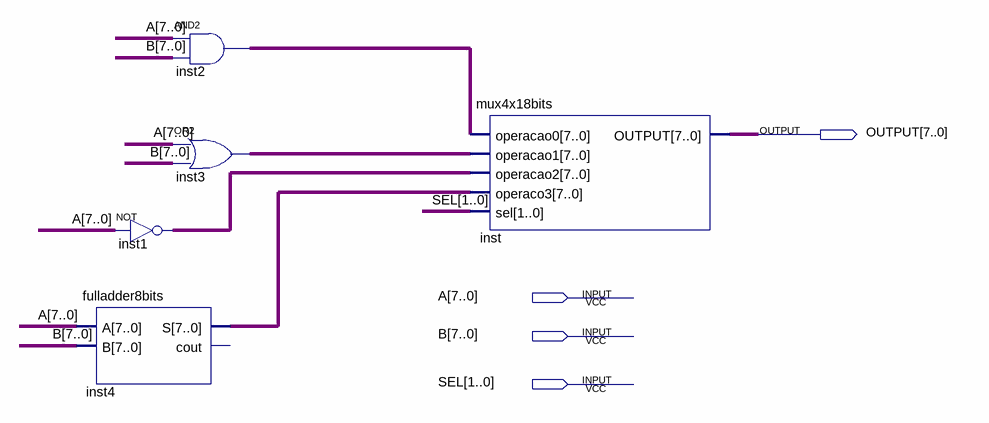
[diagram p0: schematic sheet]
// Quartus schematic ula.bdf as structural Verilog: 5 symbols, 4 pins
module ula (
  input  [7:0] A,
  input  [7:0] B,
  input  [1:0] SEL,
  output [7:0] OUTPUT
);

  wire [7:0] inst1_out, inst2_out, inst3_out, inst4_s;

  fulladder8bits inst4 (.A(A), .B(B), .S(inst4_s));  // open: cout
  assign inst2_out = A & B;  // AND2 inst2, 8 bits wide
  assign inst3_out = A | B;  // OR2 inst3, 8 bits wide
  assign inst1_out = ~A;  // NOT inst1, 8 bits wide
  mux4x18bits inst (
    .operacao0(inst2_out), .operacao1(inst3_out), .operacao2(inst1_out), .operaco3(inst4_s), .sel(SEL),
    .OUTPUT(OUTPUT));
endmodule
